# Altium schematic sheet universal_stm32.SchDoc
size A3; CompanyName: 瀬沼電子; Organization: 瀬沼電子; Address1: 〒197-0827; Address2: 東京都あきる野; Address3: 油平259; Phone: 042-558-0141; Rule: PcbType=ProtelPcb
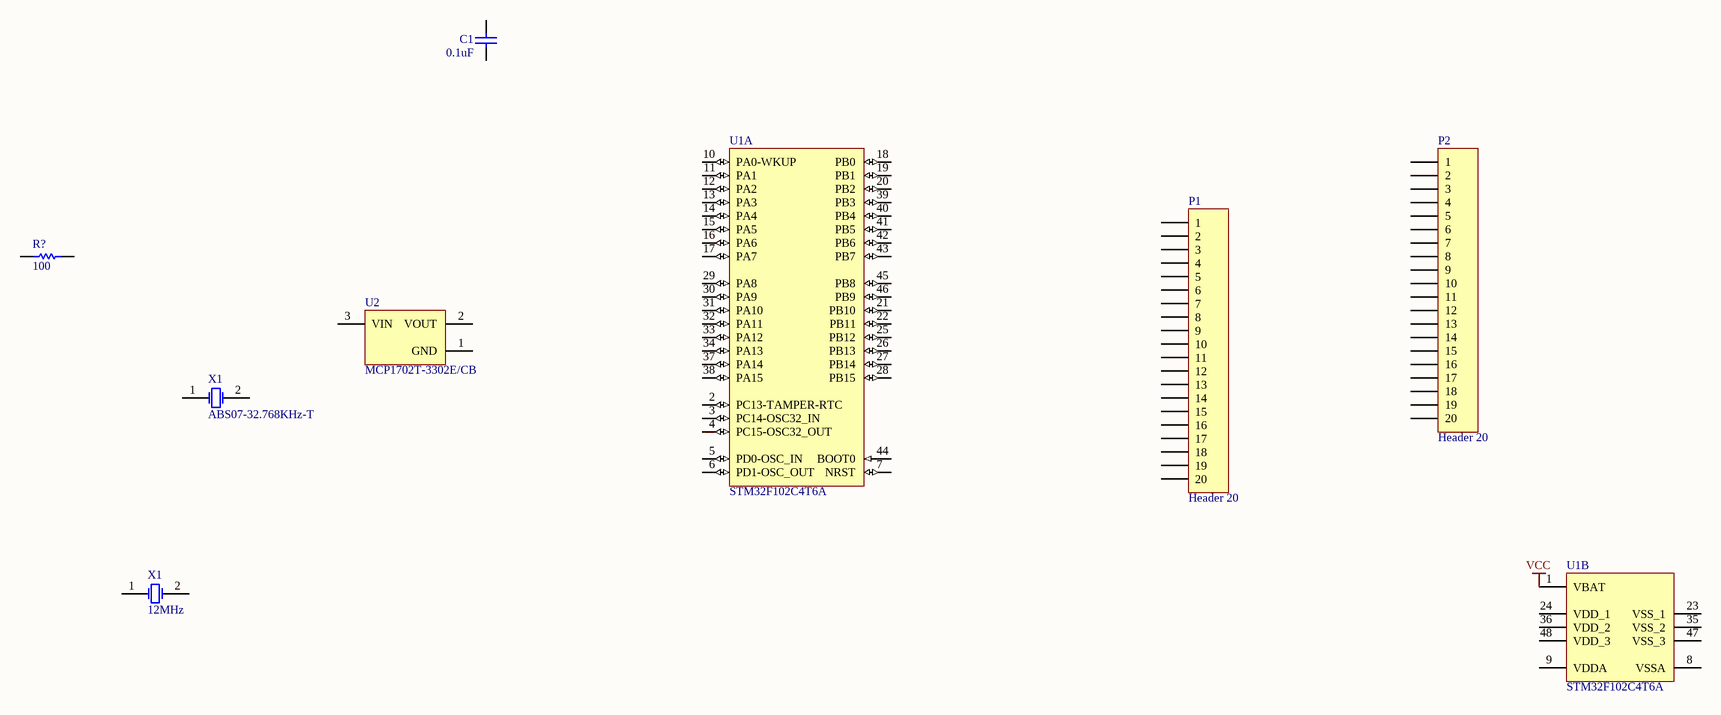
[diagram p0: universal_stm32.SchDoc]

## Parts
(Parts that share a designator on the sheet are numbered #1, #2 ... from top to bottom, then left to right.)
C1  value 0.1uF  [CAPC0603(1608)100_M]  (hidden comment: CAP 0.1uF 6.3V 0603(1608))
P1  Header 20  [HDR1X20]
P2  Header 20  [HDR1X20]
R?  100  [RESC0603(1608)_N]
U1  STM32F102C4T6A  [STM-LQFP48_N]  (parts A,B of 2)
U2  MCP1702T-3302E/CB  [SOT-23A-CB3_N]
X1#1  ABS07-32.768KHz-T  [ABRA-ABS07-2_V]
X1#2  12MHz  [ABRA-ABLS2-2_V]

## Nets
VCC: U1.1(VBAT)

Not connected (* = marked no-connect by the designer): C1 1 2; P1 1 2 3 4 5 6 7 8 9 10 11 12 13 14 15 16 17 18 19 20; P2 1 2 3 4 5 6 7 8 9 10 11 12 13 14 15 16 17 18 19 20; R? 1 2; U1 2(PC13-TAMPER-RTC) 3(PC14-OSC32_IN) 4(PC15-OSC32_OUT) 5(PD0-OSC_IN) 6(PD1-OSC_OUT) 7(NRST) 8(VSSA) 9(VDDA) 10(PA0-WKUP) 11(PA1) 12(PA2) 13(PA3) 14(PA4) 15(PA5) 16(PA6) 17(PA7) 18(PB0) 19(PB1) 20(PB2) 21(PB10) 22(PB11) 23(VSS_1) 24(VDD_1) 25(PB12) 26(PB13) 27(PB14) 28(PB15) 29(PA8) 30(PA9) 31(PA10) 32(PA11) 33(PA12) 34(PA13) 35(VSS_2) 36(VDD_2) 37(PA14) 38(PA15) 39(PB3) 40(PB4) 41(PB5) 42(PB6) 43(PB7) 44(BOOT0) 45(PB8) 46(PB9) 47(VSS_3) 48(VDD_3); U2 1(GND) 2(VOUT) 3(VIN); X1#1 1(X1) 2(X2); X1#2 1(X1) 2(X2)

## Notes on the sheet
- Title:
- A3
- Designer:
- Company:
- Revisions:
- Notes:
- Dept.:
- Email:
- File:
- rev:
- sheet:
- of
- Marked:

## Library data of the parts
C1 = CMP-1035-01870-1: CAP 0.1uF 6.3V Â±20% 0603 (1608 Metric) Thickness 1mm SMD; Case-Metric: 1608; Case-EIA: 0603; Max Thickness: 1 mm; Rated Voltage: 6.3 V; Technology: SMT; Tolerance: Â±20%
P1 P2 = Header 20: Header, 20-Pin; LatestRevisionDate: 17-Jul-2002; LatestRevisionNote: Re-released for DXP Platform.; Publisher: Altium Limited
R? = CMP-1012-00514-1: 10K 0.1W 1% 0603 (1608 Metric)  SMD; Case-Metric: 1608; Case-EIA: 0603; Technology: SMT; Tolerance: 1 %; Value: 100; Power: 0.1 W
U1 = CMP-0237-00179-3: ARM Cortex-M3 32-bit MCU, 16 KB Flash, 4 KB Internal RAM, 37 I/Os, 48-pin LQFP, -40 to 85 degC, Tray; A/D Converter: 1x12-bit (10 Channel); Operating Frequency(F) (Processor speed) (MHz): 48; FLASH Size (Prog) (kB): 16; I/Os (High Current): 37; Supply Voltage(Vcc) min (V): 2; Internal RAM Size (kB): 4; PartNumber: STM32F102C4T6A; ComponentLink3Description: Package Specification; ComponentLink1URL: http://www.st.com/web/en/home.html; DatasheetVersion: Rev. 4; PackageReference: LQFP48; Core: ARM Cortex-M3; PackageVersion: Rev. 6, 06/2013; ComponentLink1Description: Manufacturer URL; Packing: Tray; ComponentLink3URL: http://www.st.com/st-web-ui/static/active/en/resource/technical/document/datasheet/DM00058181.pdf; PackageDescription: 48-Pin Low Profile Quad Flat Package, 7 x 7 mm Body, 0.5 mm Pitch; ComponentLink2Description: Datasheet; ComponentLink2URL: http://www.st.com/st-web-ui/static/active/en/resource/technical/document/datasheet/CD00210833.pdf; Mounting Technology: Surface Mount; PartId: 1
U2 = CMP-0136-00799-1: 250 mA Low Quiescent Current LDO Regulator, 3-Pin SOT-23A, Extended Temperature, Tape and Reel; DatasheetVersion: revD, Jun-2009; PackageVersion: revBB, Aug-2009; PackageReference: SOT-23A-CB3; PackageDescription: 3-Lead Plastic Small Outline Transistor (CB) [SOT-23A]
X1#1 = CMP-0447-00001-2: Crystal, 32.768 kHz, 12.5 pF, -40 to 85 degC, SMD Low Profile 3.2 x 1.5 x 0.9 mm, Tape and Reel; Manufacturer: Abracon; Q Value (Type): 30000; Operation Mode: Flexural Mode (Tuning Fork); Shunt Capacitance (C0): 0.9 to 1.2 pF; Load Capacitance (CL): 12.5 pF; Frequency Tolerance @+25degC: +/- 20 ppm; Drive Level (Type): 0.1 uW; Equivalent Series Resistance (R1): 70 Kohm; Insulation Resistance (Min): 500 Mohm; ComponentLink3URL: http://www.abracon.com/Resonators/ABS07.pdf; PackageDescription: 2-Pin Hand Drawn, Body 3.2x1.5mm, Pitch 2.5mm; Operating Temperature: -40 to 85 degC; ComponentLink2URL: http://www.abracon.com/Resonators/ABS07.pdf; PackageReference: ABS07-2; ComponentLink3Description: Package Specification; ComponentLink1Description: Manufacturer URL; DatasheetVersion: 04.03.13; Mounting Technology: Surface Mount; ComponentLink2Description: Datasheet; ComponentLink1URL: http://www.abracon.com/; PartNumber: ABS07-32.768KHz-T; Packing: Tape and Reel; Frequency: 32.768 kHz
X1#2 = CMP-0277-00002-1: Low Profile Surface Mount Microprocessor Crystal, 4.096 MHz +/-30 ppm, 180 Ohm, -40 to 85 degC, 2-Pin 11.4 x 4.7 x 3.3 mm SMD, RoHS, Tape and Reel; Manufacturer: Abracon; PartNumber: ABLS2-4.096MHZ-D4Y-T; Operation Mode: Fundamental or 3rd Overtone; Shunt Capacitance: 7 pF Max.; ESR: 180 Ohm; Load Capacitance: 18 pF; Mounting Technology: Surface Mount; PackageDescription: 2-Pin SMD, Body 11.4 x 4.7 mm, Height 3.3 mm; ComponentLink1URL: http://www.abracon.com/; Freq. Stability: +/- 30 ppm; ComponentLink2Description: Datasheet; Operating Temp. Range: -40 to 85 degC; Packing: Tape and Reel; RoHS: TRUE; PackageReference: ABLS2-2; DatasheetVersion: Rev. 03.31.11; Freq. Tolerance: +/- 30 ppm; Frequency: 12MHz; ComponentLink2URL: http://www.abracon.com/Resonators/ABLS2.pdf; ComponentLink1Description: Manufacturer URL